# Altium project pca10095.PrjPCB (part 4 of 5)

## Sheet pca10095_sheet6_power_supply.SchDoc: PCA10095 - Power Supply
size A3; Organization: Nordic Semiconductor; DocumentNumber: 6; Revision: 2.0.0; SheetNumber: 6; SheetTotal: 6; Author: GETR; CompanyName: Nordic Semiconductor; ProjectName: nRF53 Development Kit
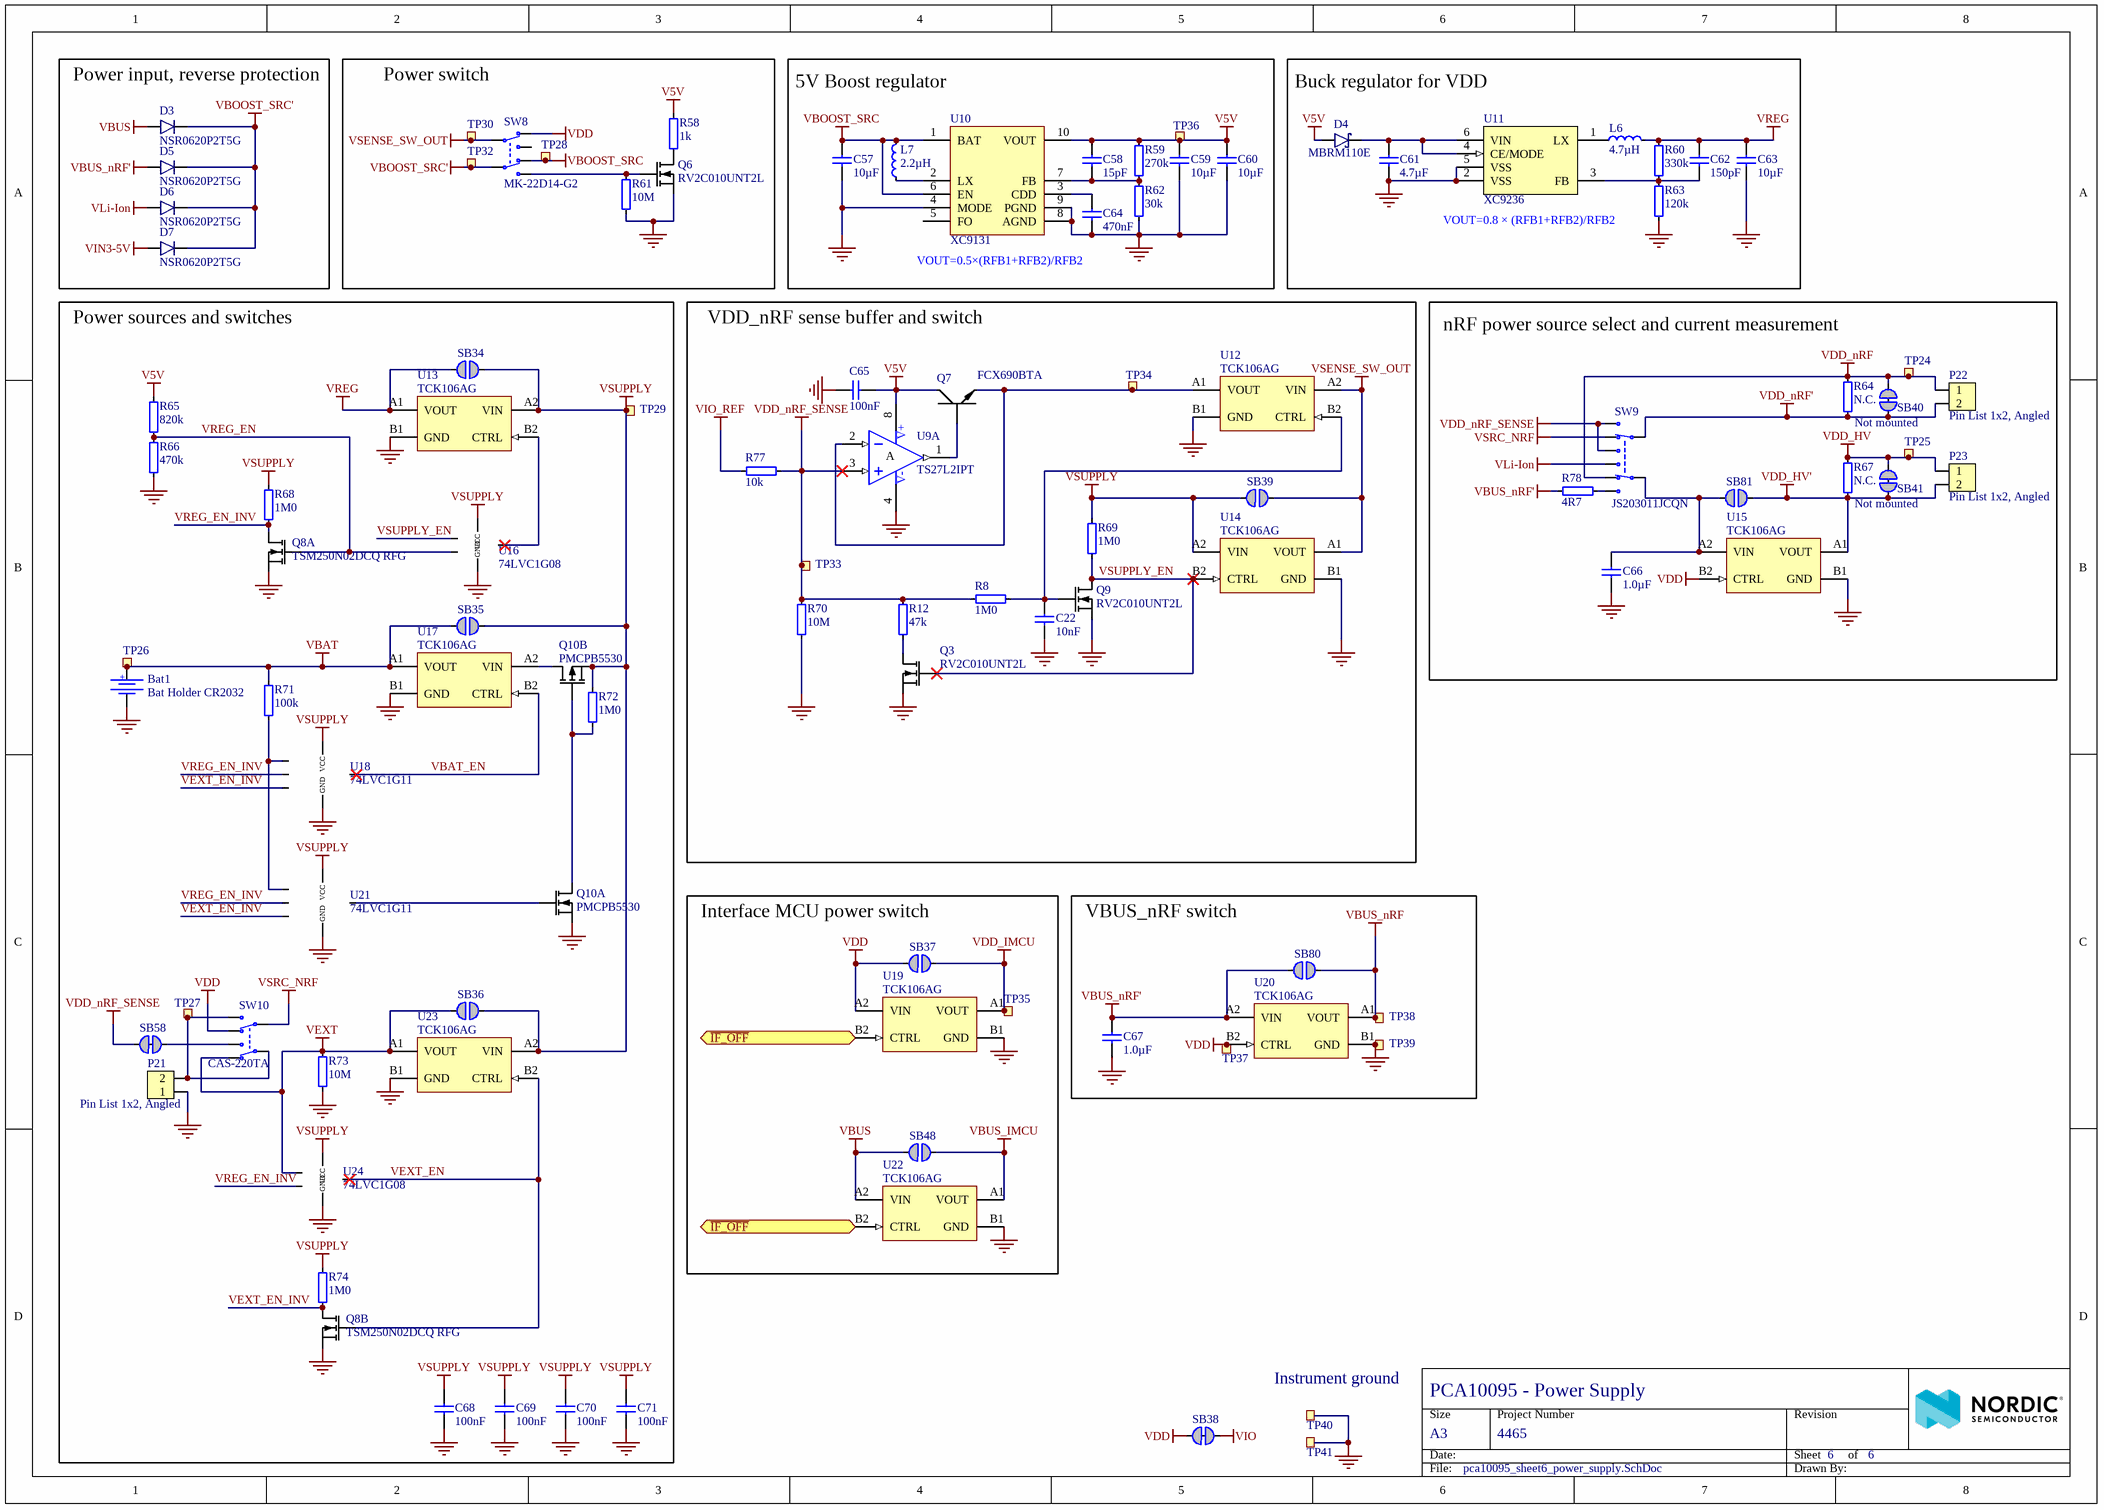
[diagram p5: pca10095_sheet6_power_supply.SchDoc]

### Parts
Bat1  Bat Holder CR2032  [L-KLS5-CR2032-23-B1]
C22  10nF  [CAPC0603X03L_C]
C57  10µF  [CAPC1608X06L]
C58  15pF  [CAPC0603X03L_C]
C59  10µF  [CAPC1608X06L]
C60  10µF  [CAPC1608X06L]
C61  4.7µF  [CAPC1005X04L]
C62  150pF  [CAPC0603X03L_C]
C63  10µF  [CAPC1608X06L]
C64  470nF  [CAPC0603X03L_C]
C65  100nF  [CAPC0603X03L_C]
C66  1.0µF  [CAPC1005X04L]
C67  1.0µF  [CAPC1608X06L]
C68  100nF  [CAPC0603X03L_C]
C69  100nF  [CAPC0603X03L_C]
C70  100nF  [CAPC0603X03L_C]
C71  100nF  [CAPC0603X03L_C]
D3  NSR0620P2T5G  [SODFL100X40-2N]
D4  MBRM110E  [DO-216AA]
D5  NSR0620P2T5G  [SODFL100X40-2N]
D6  NSR0620P2T5G  [SODFL100X40-2N]
D7  NSR0620P2T5G  [SODFL100X40-2N]
L6  4.7µH  [TY-NR3015]
L7  2.2µH  [TY-NR3015]
P21  Pin List 1x2, Angled  [LIST_ANG_1x2-SMD-2.54MM]
P22  Pin List 1x2, Angled  [LIST_ANG_1x2-SMD-2.54MM]
P23  Pin List 1x2, Angled  [LIST_ANG_1x2-SMD-2.54MM]
Q3  RV2C010UNT2L  [DFN65P100X40-3L]
Q6  RV2C010UNT2L  [DFN65P100X40-3L]
Q7  FCX690BTA  [SOT89-150P409X160-3N]
Q8  TSM250N02DCQ RFG  [DFN65P200X200X80_HS-6N]  (parts A,B of 2)
Q9  RV2C010UNT2L  [DFN65P100X40-3L]
Q10  PMCPB5530  [PMCPB5530X]  (parts A,B of 2)
R8  1M0  [RESC0603X03L_C]
R12  47k  [RESC0603X03L_C]
R58  1k  [RESC0603X03L_C]
R59  270k  [RESC0603X03L_C]
R60  330k  [RESC0603X03L_C]
R61  10M  [RESC0603X03L_C]
R62  30k  [RESC0603X03L_C]
R63  120k  [RESC0603X03L_C]
R64  N.C.  Assembly: Not mounted  [RESC1005X04L_NC]
R65  820k  [RESC0603X03L_C]
R66  470k  [RESC0603X03L_C]
R67  N.C.  Assembly: Not mounted  [RESC1005X04L_NC]
R68  1M0  [RESC0603X03L_C]
R69  1M0  [RESC0603X03L_C]
R70  10M  [RESC0603X03L_C]
R71  100k  [RESC0603X03L_C]
R72  1M0  [RESC0603X03L_C]
R73  10M  [RESC0603X03L_C]
R74  1M0  [RESC0603X03L_C]
R77  10k  [RESC0603X03L_C]
R78  4R7  [RESC0603X03L_C]
SB34  Solderbridge  [Solderbridge]  (value not drawn)  (no BOM)
SB35  Solderbridge  [Solderbridge]  (value not drawn)  (no BOM)
SB36  Solderbridge  [Solderbridge]  (value not drawn)  (no BOM)
SB37  Solderbridge  [Solderbridge]  (value not drawn)  (no BOM)
SB38  Solderbridge  [Solderbridge_Shorted]  (value not drawn)  (net tie, no BOM)
SB39  Solderbridge  [Solderbridge]  (value not drawn)  (no BOM)
SB40  Solderbridge  [Solderbridge_Shorted]  (value not drawn)  (net tie, no BOM)
SB41  Solderbridge  [Solderbridge_Shorted]  (value not drawn)  (net tie, no BOM)
SB48  Solderbridge  [Solderbridge]  (value not drawn)  (no BOM)
SB58  Solderbridge  [Solderbridge_Shorted]  (value not drawn)  (net tie, no BOM)
SB80  Solderbridge  [Solderbridge]  (value not drawn)  (no BOM)
SB81  Solderbridge  [Solderbridge]  (value not drawn)  (no BOM)
SW8  MK-22D14-G2  [MK-22D14-G2]
SW9  JS203011JCQN  [Switch-Slide-J-Lead-DP3T-13x3.5mm]
SW10  CAS-220TA  [CAS-220TA]
TP24  Ø1.5mm,SMD  [TP_SMD_Ø1.5mm]  (value not drawn)  (no BOM)
TP25  Ø1.5mm,SMD  [TP_SMD_Ø1.5mm]  (value not drawn)  (no BOM)
TP26  Ø1.5mm,SMD  [TP_SMD_Ø1.5mm]  (value not drawn)  (no BOM)
TP27  Ø1.5mm,SMD  [TP_SMD_Ø1.5mm]  (value not drawn)  (no BOM)
TP28  Ø1.5mm,SMD  [TP_SMD_Ø1.5mm]  (value not drawn)  (no BOM)
TP29  Ø1.0mm,SMD  [TP_SMD_Ø1.0mm]  (value not drawn)  (no BOM)
TP30  Ø1.5mm,SMD  [TP_SMD_Ø1.5mm]  (value not drawn)  (no BOM)
TP32  Ø1.5mm,SMD  [TP_SMD_Ø1.5mm]  (value not drawn)  (no BOM)
TP33  Ø1.0mm,SMD  [TP_SMD_Ø1.0mm]  (value not drawn)  (no BOM)
TP34  Ø1.0mm,SMD  [TP_SMD_Ø1.0mm]  (value not drawn)  (no BOM)
TP35  Ø1.5mm,SMD  [TP_SMD_Ø1.5mm]  (value not drawn)  (no BOM)
TP36  Ø1.0mm,SMD  [TP_SMD_Ø1.0mm]  (value not drawn)  (no BOM)
TP37  Ø1.5mm,SMD  [TP_SMD_Ø1.5mm]  (value not drawn)  (no BOM)
TP38  Ø1.5mm,SMD  [TP_SMD_Ø1.5mm]  (value not drawn)  (no BOM)
TP39  Ø1.5mm,SMD  [TP_SMD_Ø1.5mm]  (value not drawn)  (no BOM)
TP40  TP  [TESTPAD-TH]  (value not drawn)  (no BOM)
TP41  TP  [TESTPAD-TH]  (value not drawn)  (no BOM)
U9  TS27L2IPT  [TSOP65P640X120-8N]  (part A of 2)
U10  XC9131  [10-USPB (2.9x2.6)]
U11  XC9236  [USP-6C]
U12  TCK106AG  [BGA4C40P2X2_76X76X62]
U13  TCK106AG  [BGA4C40P2X2_76X76X62]
U14  TCK106AG  [BGA4C40P2X2_76X76X62]
U15  TCK106AG  [BGA4C40P2X2_76X76X62]
U16  74LVC1G08  [SOT65P210X100-5N]
U17  TCK106AG  [BGA4C40P2X2_76X76X62]
U18  74LVC1G11  [SOT65P210X100-6N]
U19  TCK106AG  [BGA4C40P2X2_76X76X62]
U20  TCK106AG  [BGA4C40P2X2_76X76X62]
U21  74LVC1G11  [SOT65P210X100-6N]
U22  TCK106AG  [BGA4C40P2X2_76X76X62]
U23  TCK106AG  [BGA4C40P2X2_76X76X62]
U24  74LVC1G08  [SOT65P210X100-5N]

### Blocks framed on the sheet
Power input, reverse protection: D3 D5-D7
Power switch: Q6 R58 R61 SW8 TP28 TP30 TP32
5V Boost regulator: C57-C60 C64 L7 R59 R62 TP36 U10
Buck regulator for VDD: C61-C63 D4 L6 R60 R63 U11
Power sources and switches: Bat1 C68-C71 P21 Q8 Q10 R65 R66 R68 R71-R74 SB34-SB36 SB58 SW10 TP26 TP27 TP29 U13 U16-U18 U21 U23 U24
VDD_nRF sense buffer and switch: C22 C65 Q3 Q7 Q9 R8 R12 R69 R70 R77 SB39 TP33 TP34 U9 U12 U14
nRF power source select and current measurement: C66 P22 P23 R64 R67 R78 SB40 SB41 SB81 SW9 TP24 TP25 U15
Interface MCU power switch: SB37 SB48 TP35 U19 U22
VBUS_nRF switch: C67 SB80 TP37-TP39 U20

### Ports
~{IF_OFF} (bidir)

### Nets
GND: Bat1.2 C22.2 C57.1 C59.1 C60.1 C61.1 C63.1 C64.1 C65.1 C66.1 C67.1 C68.1 C69.1 C70.1 C71.1 P21.1 Q3.2(S) Q6.2(S) Q8.1(S1) Q8.4(S2) Q9.2(S) Q10.1(S1) R61.2 R62.1 R63.1 R66.2 R70.2 R73.2 TP39.1 TP40.1 TP41.1 U9.4(V-) U10.4(MODE) U10.8(AGND) U10.9(PGND) U10.11(GND) U11.2(VSS) U11.5(VSS) U11.7(VSS) U12.B1(GND) U13.B1(GND) U14.B1(GND) U15.B1(GND) U16.3(GND) U17.B1(GND) U18.2(GND) U19.B1(GND) U20.B1(GND) U21.2(GND) U22.B1(GND) U23.B1(GND) U24.3(GND)
V5V: C58.2 C59.2 C60.2 C65.2 D4.1(A) Q7.2(C) R58.1 R59.2 R65.1 TP36.1 U9.8(V+) U10.10(VOUT)
VBAT: Bat1.1 R71.1 SB35.2 TP26.1 U17.A1(VOUT)
VBOOST_SRC: C57.2 L7.2 SW8.6(N.C-2) TP28.1 U10.1(BAT) U10.6(EN)
VBOOST_SRC': D3.1(C) D5.1(C) D6.1(C) D7.1(C) SW8.5(COM-2) TP32.1
VBUS: D3.2(A) SB48.2 U22.A2(VIN)
VBUS_IMCU: SB48.1 U22.A1(VOUT)
VBUS_nRF: SB80.1 TP38.1 U20.A1(VOUT)
VBUS_nRF': C67.2 D5.2(A) R78.1 SB80.2 U20.A2(VIN)
VDD: SB37.2 SB38.2 SW8.3(N.C-1) SW10.6(N.C-2) TP37.1 U15.B2(CTRL) U19.A2(VIN) U20.B2(CTRL)
VDD_HV: P23.1 R67.2 SB41.1 TP25.1
VDD_HV': P23.2 R67.1 SB41.2 SB81.1 U15.A1(VOUT)
VDD_IMCU: SB37.1 TP35.1 U19.A1(VOUT)
VDD_nRF: P22.1 R64.2 SB40.1 SW9.6(N.C) TP24.1
VDD_nRF': P22.2 R64.1 SB40.2 SW9.3(COM)
VDD_nRF_SENSE: R8.1 R12.1 R70.1 R77.1 SB58.1 SW9.1(N.O) SW9.4(N.O) TP33.1 U9.3(IN1+)
VEXT: R73.1 SB36.2 SW10.3(N.C-1) U23.A1(VOUT) U24.1(A)
VIN3-5V: D7.2(A)
VIO: SB38.1
VIO_REF: R77.2
VLi-Ion: D6.2(A) SW9.5(N.O)
VREG: C62.2 C63.2 L6.2 R60.2 SB34.2 U13.A1(VOUT)
VSENSE_SW_OUT: SB39.1 SW8.2(COM-1) TP30.1 U12.A2(VIN) U14.A1(VOUT)
VSRC_NRF: SW9.2(N.C) SW10.5(COM-2)
VSUPPLY: C68.2 C69.2 C70.2 C71.2 Q10.4(S2) R68.1 R69.1 R72.1 R74.1 SB34.1 SB35.1 SB36.1 SB39.2 TP29.1 U13.A2(VIN) U14.A2(VIN) U16.5(VCC) U18.5(VCC) U21.5(VCC) U23.A2(VIN) U24.5(VCC)
~{IF_OFF}: U19.B2(CTRL) U22.B2(CTRL) ; port ~{IF_OFF}
VBAT_EN: U17.B2(CTRL) U18.4(Y)
VEXT_EN: Q8.5(G2) U23.B2(CTRL) U24.4(Y)
VEXT_EN_INV: Q8.3(D2) R74.2 U18.6(C) U21.6(C)
VREG_EN: Q8.2(G1) R65.2 R66.1 U16.2(B)
VREG_EN_INV: Q8.6(D1) R68.2 U18.3(B) U21.3(B) U24.2(B)
VSUPPLY_EN: Q3.1(G) Q9.3(D) R69.2 U14.B2(CTRL) U16.1(A)
NetC22_1: C22.1 Q9.1(G) R8.2 U12.B2(CTRL)
NetC58_1: C58.1 R59.1 R62.2 U10.7(FB)
NetC61_2: C61.2 D4.3(C) U11.4(CE/MODE) U11.6(VIN)
NetC62_1: C62.1 R60.1 R63.2 U11.3(FB)
NetC64_2: C64.2 U10.3(CDD)
NetC66_2: C66.2 SB81.2 SW9.7(COM) U15.A2(VIN)
NetL6_1: L6.1 U11.1(LX)
NetL7_1: L7.1 U10.2(LX)
NetP21_2: P21.2 SW10.2(COM-1) SW10.4(N.O-2) TP27.1
NetQ3_3: Q3.3(D) R12.2
NetQ6_1: Q6.1(G) R61.1 SW8.4(N.O-2)
NetQ6_3: Q6.3(D) R58.2
NetQ7_1: Q7.1(B) U9.1(OUT1)
NetQ7_3: Q7.3(E) TP34.1 U9.2(IN1-) U12.A1(VOUT)
NetQ10_2: Q10.2(G1) U21.4(Y)
NetQ10_3: Q10.3(D2) U17.A2(VIN)
NetQ10_5: Q10.5(G2) Q10.6(D1) R72.2
NetR71_2: R71.2 U18.1(A) U21.1(A)
NetR78_2: R78.2 SW9.8(N.O)
NetSB58_2: SB58.2 SW10.1(N.O-1)
NetU13_B2: U13.B2(CTRL) U16.4(Y)

Not connected (* = marked no-connect by the designer): SW8 1(N.O-1); U10 5(FO)

### Notes on the sheet
- VOUT=0.8 × (RFB1+RFB2)/RFB2
- VOUT=0.5×(RFB1+RFB2)/RFB2
- (near TP40) Instrument ground
- Size
- Date:
- A3
- Project Number
- Sheet         of
- Revision
- File:
- Drawn By:
- (in symbol Bat Holder L-KLS5-CR2032-23-B1) +
- (in symbol TS27L2IPT, part A) A

### Library data of the parts
Bat1 = Bat Holder L-KLS5-CR2032-23-B1: Bat Holder CR2032 SMD; Manufacturer: KLS Electronic; Artikkelnr Noca: N.A.; Pad Count: 2; Part Number: Bat Holder L-KLS5-CR2032-23-B1; Manufacturer Part Number: L-KLS5-CR2032-23-B1; ComponentLink1URL: http://www.klsele.com/admin/product_upload/20151124103736KLS5-CR2032-23-B.pdf; ComponentLink1Description: Datasheet; ComponentLink2URL: N.A.; ComponentLink2Description: Supplier link; HelpURL: http://www.klsele.com/products/connectors/Coin-Cell-Holders-Series/4685.html; Footprint Doc: CR2032_HOLDER; LatestRevisionDate: 2019-08-29; Published: 2019-08-28; Value: Bat Holder CR2032; Note: Bat Holder CR2032; Supplier 1: Cabcon; Supplier Part Number 1: L-KLS5-CR2032-23-B1; Supplier 2: Mouser; Supplier Part Number 2: 614-SMTU2032-LF; Part number IPS: N.A.; PartId: 100500651; Component Class: Connectors; Author: rsk; Part number Norautron: N.A.
C22 = C0201-10n: Capacitor, X7R, ±10%; Manufacturer: N.A.; Part number IPS: 00000003480; Note: 10V; Pad Count: 2; Part Number: C0201-10n; LatestRevisionDate: 2017-11-09; Published: 2014-11-13; Value: 10nF; Footprint Doc: 0201; Manufacturer Part Number: N.A.; Artikkelnr Noca: N.A.; ComponentLink1URL: N.A.; ComponentLink1Description: Datasheet; ComponentLink2URL: N.A.; ComponentLink2Description: Supplier link; HelpURL: N.A.; Supplier 1: N.A.; Supplier Part Number 1: N.A.; Supplier 2: N.A.; Supplier Part Number 2: N.A.; Component Class: Capacitors; PartId: 100200067
C57 C59 C60 C63 = C0603-10µ-25V: Capacitor, X5R, ±20%, 25V; Manufacturer: Samsung Electro-Mechanics America; Manufacturer Part Number: CL10A106MA8NRNC; Part number IPS: 00000009948; Part number Norautron: N.A.; Artikkelnr Noca: 20039436; Pad Count: 2; Part Number: C0603-10µ-25V; Footprint Doc: 0603; LatestRevisionDate: 2015-04-10; Published: 2015-04-10; Value: 10µF; Note: 25V; ComponentLink1URL: N.A.; ComponentLink1Description: Datasheet; ComponentLink2URL: N.A.; ComponentLink2Description: Supplier link; HelpURL: http://www.samsungsem.com/kr/front/downloadcms.do?path=/kr/support/product-search/mlcc/__icsFiles/afieldfile/2014/11/05&fileName=S_CL10A106MA8NRNC.pdf; Supplier 1: Digi-Key; Supplier Part Number 1: 1276-1869-1-ND; Supplier 2: N.A.; Supplier Part Number 2: N.A.; PartId: 100200354; Component Class: Capacitors; Author: rsk
C58 = C0201-15p-25V-COG: Ceramic Capacitor C0G, NP0 0201, ±5% 25V; Manufacturer: Walsin Technology Corporation; Manufacturer Part Number: 0201N150J250CT; Note: Chip Cap 5%; Artikkelnr Noca: N.A.; Pad Count: 2; Part Number: C0201-15p-25V-COG; Footprint Doc: 0201; LatestRevisionDate: 2020-10-13; Pin Count: 2; Publisher: Nordic Semiconductor; Published: 2020-03-17; Value: 15pF; Part number IPS: N.A.; ComponentLink1URL: http://www.passivecomponent.com/wp-content/uploads/ecd/0201N150J250CT-IL.pdf; ComponentLink1Description: Datasheet; ComponentLink2URL: https://www.digikey.no/product-detail/en/walsin-technology-corporation/0201N150J250CT/1292-1138-1-ND/9355142; ComponentLink2Description: Supplier link; HelpURL: N.A.; Supplier 1: Digi-Key; Supplier Part Number 1: 1292-1138-1-ND; Supplier 2: N.A.; Supplier Part Number 2: N.A.; Component Class: Capacitors; PartId: 100200443
C61 = C0402-4µ7-10V-X5R: CAP CER 4.7UF 10V X5R 0402; Manufacturer: Murata; Manufacturer Part Number: GRM155R61A475MEAAD; Artikkelnr Noca: N.A.; Pad Count: 2; Part Number: C0402-4µ7-10V-X5R; ComponentLink1URL: http://search.murata.co.jp/Ceramy/image/img/A01X/G101/ENG/GRM155R61A475MEAA-01.pdf; ComponentLink1Description: Datasheet; ComponentLink2URL: https://www.digikey.com/product-detail/en/murata-electronics-north-america/GRM155R61A475MEAAD/490-14306-1-ND/6234742; ComponentLink2Description: Supplier link; HelpURL: https://psearch.en.murata.com/capacitor/product/GRM155R61A475MEAA%23.html; Footprint Doc: 0402; LatestRevisionDate: 2020-10-13; Pin Count: 2; Publisher: Nordic Semiconductor; Published: 2018-10-04; Value: 4.7µF; Note: 10V; Supplier 1: Digi-Key; Supplier Part Number 1: 490-14306-1-ND; Supplier 2: N.A.; Supplier Part Number 2: N.A.; Part number IPS: N.A.; Component Class: Capacitors; PartId: 100200415
C62 = C0201-150p-25V-COG: Ceramic Capacitor C0G, NP0 0201, ±5% 25V; Manufacturer: Murata; Manufacturer Part Number: GRM0335C1E151JA01D; Note: Chip Cap 5%; Artikkelnr Noca: N.A.; Pad Count: 2; Part Number: C0201-150p-25V-COG; Footprint Doc: 0201; LatestRevisionDate: 2020-10-13; Pin Count: 2; Publisher: Nordic Semiconductor; Published: 2020-03-17; Value: 150pF; Part number IPS: N.A.; ComponentLink1URL: https://www.mouser.com/datasheet/2/281/murata_03052018_GRM_Series_1-1310166.pdf; ComponentLink1Description: Datasheet; ComponentLink2URL: https://www.mouser.com/ProductDetail/Murata-Electronics/GRM0335C1E151JA01D?qs=%2Fha2pyFaduiNjPL6xbzKSo%252BchgTMqklsGrBRdYVX326W%252BRpjq1WqAQZ5mC%252Bu6szW; ComponentLink2Description: Supplier link; HelpURL: N.A.; Supplier 1: Digi-Key; Supplier Part Number 1: 1292-1138-1-ND; Supplier 2: N.A.; Supplier Part Number 2: N.A.; Component Class: Capacitors; PartId: 100200444
C64 = C0201-470n-16V-X5R: Ceramic Capacitor X5R 0201, ±10% 16V; Manufacturer: Taiyo Yuden; Manufacturer Part Number: EMK063BBJ474KPLF; Artikkelnr Noca: N.A.; Pad Count: 2; Part Number: C0201-470n-16V-X5R; Footprint Doc: 0201; LatestRevisionDate: 2020-10-13; Pin Count: 2; Publisher: Nordic Semiconductor; Published: 2020-03-05; Value: 470nF; Note: 16V; Part number IPS: N.A.; ComponentLink1URL: https://ds.yuden.co.jp/TYCOMPAS/ut/specSheet?pn=EMK063BBJ474KPLF; ComponentLink1Description: Datasheet; ComponentLink2URL: https://ds.yuden.co.jp/TYCOMPAS/ut/sm/detail?pn=EMK063BBJ474KPLF&u=M; ComponentLink2Description: Supplier link; HelpURL: https://www.digikey.no/products/en?keywords=587-6264-1-ND; Supplier 1: Digi-Key; Supplier Part Number 1: 587-6264-1-ND; Supplier 2: N.A.; Supplier Part Number 2: N.A.; Component Class: Capacitors; PartId: 100200442
C65 C68-C71 = C0201-100n: Capacitor, X5R, ±10%; Manufacturer: N.A.; Part number IPS: 00000001248, 00000002505; Note: 16V; Pad Count: 2; Part Number: C0201-100n; Manufacturer Part Number: N.A.; Footprint Doc: 0201; LatestRevisionDate: 2017-11-09; Pin Count: 2; Publisher: Nordic Semiconductor; Published: 2014-11-13; Value: 100nF; Artikkelnr Noca: N.A.; ComponentLink1URL: N.A.; ComponentLink1Description: Datasheet; ComponentLink2URL: N.A.; ComponentLink2Description: Supplier link; HelpURL: N.A.; Supplier 1: N.A.; Supplier Part Number 1: N.A.; Supplier 2: N.A.; Supplier Part Number 2: N.A.; Component Class: Capacitors; PartId: 100200078
C66 = C0402-1µ0: Capacitor, X5R, ±5%, 6.3V; Manufacturer: N.A.; Part number IPS: 00000007786, 00000003457; Artikkelnr Noca: 20039235; Pad Count: 2; Part Number: C0402-1µ0; Manufacturer Part Number: N.A.; LatestRevisionDate: 2016-08-22; Pin Count: 2; Publisher: Nordic Semiconductor; Published: 2009-05-08; Value: 1.0µF; Note: 6.3V; Footprint Doc: 0402; ComponentLink1URL: N.A.; ComponentLink1Description: Datasheet; ComponentLink2URL: N.A.; ComponentLink2Description: Supplier link; HelpURL: N.A.; Supplier 1: Digi-Key; Supplier Part Number 1: 1276-1444-1-ND; Supplier 2: N.A.; Supplier Part Number 2: N.A.; Component Class: Capacitors; PartId: 100200190
C67 = C0603-1µ0: Capacitor, X7R, ±10%; Manufacturer: N.A.; Part number IPS: 00000000616; Note: 16V; Artikkelnr Noca: 20039282; Pad Count: 2; Part Number: C0603-1µ0; Manufacturer Part Number: N.A.; Footprint Doc: 0603; LatestRevisionDate: 2013-06-05; Pin Count: 2; Publisher: Nordic Semiconductor; Published: 2009-05-08; Value: 1.0µF; ComponentLink1URL: N.A.; ComponentLink1Description: Datasheet; ComponentLink2URL: N.A.; ComponentLink2Description: Supplier link; HelpURL: N.A.; Supplier 1: N.A.; Supplier Part Number 1: N.A.; Supplier 2: N.A.; Supplier Part Number 2: N.A.; Component Class: Capacitors; PartId: 100200271
D3 D5-D7 = NSR0620P2T5G: 20V schottky barrier diode, Vf 350 mV @ 100 mA, Ir 2.0 µA @ 10 V, If 500 mA; Manufacturer: ON Semiconductor; Part number IPS: 00000009952; Note: N.A.; Artikkelnr Noca: 10029169; Pad Count: 2; Part Number: NSR0620P2T5G; Manufacturer Part Number: NSR0620P2T5G; LatestRevisionDate: 2016-07-07; Publisher: Nordic Semiconductor; Published: 2016-07-07; Value: NSR0620P2T5G; Footprint Doc: SOD-923; ComponentLink1URL: N.A.; ComponentLink1Description: Datasheet; ComponentLink2URL: N.A.; ComponentLink2Description: Supplier link; HelpURL: http://www.onsemi.com/pub_link/Collateral/NSR0620P2-D.PDF; Pin Count: 2; Supplier 1: Digi-Key; Supplier Part Number 1: NSR0620P2T5GOSCT-ND; Supplier 2: N.A.; Supplier Part Number 2: N.A.; Component Class: Semiconductors; PartId: 101300131
D4 = MBRM110E: Diode Schottky Vf=0.455V @ 100mA, Vr=10V, If=1000mA, Ir=1µA @ 10V; Manufacturer: ON Semiconductor; Manufacturer Part Number: MBRM110ET1G; Part number IPS: 00000009953; Note: N.A.; Artikkelnr Noca: 10029172; Pad Count: 2; Part Number: MBRM110E; Footprint Doc: DO-216AA; LatestRevisionDate: 2016-10-24; Publisher: Nordic Semiconductor; Published: 2016-10-24; Value: MBRM110E; ComponentLink1URL: N.A.; ComponentLink1Description: Datasheet; ComponentLink2URL: N.A.; ComponentLink2Description: Supplier link; HelpURL: http://media.digikey.com/pdf/Data%20Sheets/ON%20Semiconductor%20PDFs/MBRM110E-D.pdf; Pin Count: 2; Supplier 1: Digi-Key; Supplier Part Number 1: MBRM110ET1GOSTR-ND; Supplier 2: Farnell; Supplier Part Number 2: 236-9429; Component Class: Semiconductors; PartId: 101300099
L6 = NR3015-4µ7-1.04A-144mOhm: Ferrite Inductor, Shielded, 1,04A, 144mOhm; Manufacturer: Taiyo Yuden; Manufacturer Part Number: NR3015T4R7M; Part number IPS: 00000009960; Note: N.A.; Artikkelnr Noca: 33029551; Pad Count: 2; Part Number: NR3015-4µ7-1.04A-144mOhm; Footprint Doc: 1212; LatestRevisionDate: 2014-01-22; Pin Count: 2; Publisher: Nordic Semiconductor; Published: 2014-01-22; Value: 4.7µH; ComponentLink1Description: Datasheet; ComponentLink2Description: Supplier link; ComponentLink1URL: N.A.; ComponentLink2URL: N.A.; HelpURL: http://www.yuden.co.jp/ut/product/category/inductor/NR3015T4R7M.pdf; Supplier 1: Digi-Key; Supplier Part Number 1: 587-1649-1-ND; Supplier 2: Mouser; Supplier Part Number 2: 963-NR3015T4R7M; Component Class: Inductors; PartId: 100300145
L7 = NR3015-2µ2-1.5A-72mOhm: Ferrite Inductor, Shielded, 1,5A, 72mOhm; Manufacturer: Taiyo Yuden; Manufacturer Part Number: NR3015T2R2M; Part number IPS: 00000009959; Note: N.A.; Artikkelnr Noca: 33029487; Pad Count: 2; Part Number: NR3015-2µ2-1.5A-72mOhm; Footprint Doc: 1212; LatestRevisionDate: 2014-01-22; Pin Count: 2; Publisher: Nordic Semiconductor; Published: 2014-01-22; Value: 2.2µH; ComponentLink1Description: Datasheet; ComponentLink2Description: Supplier link; ComponentLink1URL: N.A.; ComponentLink2URL: N.A.; HelpURL: http://www.yuden.co.jp/ut/product/category/inductor/NR3015T2R2M.pdf; Supplier 1: Digi-Key; Supplier Part Number 1: 587-1648-1-ND; Supplier 2: Farnell; Supplier Part Number 2: 188-5853; Component Class: Inductors; PartId: 100300143
P21-P23 = Pin List Ang 1x2 SMD, 2.54mm: Pin List 1x2, 2.54mm (100mil), Right Angled, SMD; Manufacturer: W-CON; Manufacturer Part Number: 1125B-1102S0Z135R2; Part number IPS: 00000009972; Note: N.A.; Artikkelnr Noca: 55010023; Pad Count: 2; Part Number: Pin List Ang 1x2 SMD, 2.54mm; Footprint Doc: LIST_ANG_1x2-SMD-2.54MM; LatestRevisionDate: 2016-05-26; Pin Count: 2; Publisher: Nordic Semiconductor; Published: 2016-01-22; Value: Pin List 1x2, Angled; ComponentLink1URL: N.A.; ComponentLink1Description: Datasheet; ComponentLink2URL: N.A.; ComponentLink2Description: Supplier link; HelpURL: \\hizz\pro\app9717\Datasheet\connectors\W-CON\1125B-11XXXXZXXXXX.pdf; Supplier 1: Cabcon; Supplier Part Number 1: 1125B-1102S0Z135R2; Supplier 2: Samtec; Supplier Part Number 2: TSM-102-01-L-SH-A; Component Class: Connectors; PartId: 100500354
Q3 Q6 Q9 = RV2C010UNT2L: N-Channel MOSFET, 20V, 1A, 470mOhm, 400mW; Manufacturer: Rohm Semiconductor; Part number IPS: 00000009976; Note: N.A.; Artikkelnr Noca: 35010020; Pad Count: 3; Part Number: RV2C010UNT2L; Manufacturer Part Number: RV2C010UNT2L; LatestRevisionDate: 2016-08-09; Publisher: Nordic Semiconductor; Published: 2016-08-09; Value: RV2C010UNT2L; Footprint Doc: DFN-3; ComponentLink1URL: N.A.; ComponentLink1Description: Datasheet; ComponentLink2URL: N.A.; ComponentLink2Description: Supplier link; HelpURL: http://rohmfs.rohm.com/en/products/databook/datasheet/discrete/transistor/mosfet/rv2c010unt2l-e.pdf; Pin Count: 3; Supplier 1: Digi-Key; Supplier Part Number 1: RV2C010UNT2LCT-ND; Supplier 2: Mouser; Supplier Part Number 2: 755-RV2C010UNT2L; Component Class: Semiconductors; PartId: 101300132
Q7 = FCX690BTA: 45V NPN high gain power transistor; Manufacturer: Diodes Incorporated; Part number IPS: 00000009974; Note: N.A.; Artikkelnr Noca: 35010019; Pad Count: 3; Part Number: FCX690BTA; Manufacturer Part Number: FCX690BTA; Footprint Doc: SOT-89; LatestRevisionDate: 2016-07-07; Publisher: Nordic Semiconductor; Published: 2016-07-07; Value: FCX690BTA; ComponentLink1URL: N.A.; ComponentLink1Description: Datasheet; ComponentLink2URL: N.A.; ComponentLink2Description: Supplier link; HelpURL: http://www.diodes.com/_files/datasheets/FCX690B.pdf; Pin Count: 3; Supplier 1: Digi-Key; Supplier Part Number 1: FCX690BCT-ND; Supplier 2: N.A.; Supplier Part Number 2: N.A.; Component Class: Semiconductors; PartId: 101300130
Q8 = TSM250N02DCQ RFG: Dual N Ch MOFET, 5.8A, 55mOhm max, 620mW; Manufacturer: Taiwan Semiconductor; Part number IPS: 00000001703; Note: N.A.; Pad Count: 6; Part Number: TSM250N02DCQ RFG; Manufacturer Part Number: TSM250N02DCQ RFG; LatestRevisionDate: 2018-10-31; Pin Count: 6; Publisher: Nordic Semiconductor; Published: 2018-10-31; Value: TSM250N02DCQ RFG; Artikkelnr Noca: N.A.; Footprint Doc: VDFN-6; ComponentLink1URL: https://www.taiwansemi.com/products/datasheet/TSM250N02D_B15.pdf; ComponentLink1Description: Datasheet; ComponentLink2URL: N.A.; ComponentLink2Description: Supplier link; HelpURL: https://www.taiwansemi.com/products/datasheet/TSM250N02D_B15.pdf; Supplier 1: Digi-Key; Supplier Part Number 1: TSM250N02DCQRFGCT-ND; Supplier 2: N.A.; Supplier Part Number 2: N.A.; Component Class: Semiconductors; PartId: 101300161
Q10 = PMCPB5530X,115: Mosfet Array N and P-Channel 20V 4A (Ta), 3.4A (Ta) 490mW Surface Mount 6-HUSON-EP (2x2); Manufacturer: Nexperia; Part number IPS: 00000001918; Note: N.A.; Pad Count: 8; Part Number: PMCPB5530X,115; Manufacturer Part Number: PMCPB5530X,115; ComponentLink1URL: https://assets.nexperia.com/documents/data-sheet/PMCPB5530X.pdf; ComponentLink1Description: Datasheet; ComponentLink2URL: https://www.digikey.com/product-detail/en/nexperia-usa-inc/PMCPB5530X115/1727-1327-1-ND/4386339; ComponentLink2Description: Supplier link; HelpURL: https://www.nexperia.com/products/mosfets/small-signal-mosfets/PMCPB5530X.html; Footprint Doc: 6-UDFN; LatestRevisionDate: 2018-04-30; Pin Count: 8; Publisher: Nordic Semiconductor; Published: 2018-04-30; Value: PMCPB5530; Supplier 1: Digi-Key; Supplier Part Number 1: 1727-1327-1-ND; Supplier 2: Mouser; Supplier Part Number 2: 771-PMCPB5530X115; Artikkelnr Noca: N.A.; Component Class: Semiconductors; PartId: 101300165
R8 R68 R69 R72 R74 = R0201-1M0: Resistor, ±1%, 0.05W; Manufacturer: N.A.; Part number IPS: 00000001418; Note: Chip Res 1%; Pad Count: 2; Part Number: R0201-1M0; Manufacturer Part Number: N.A.; LatestRevisionDate: 2014-11-13; Pin Count: 2; Publisher: Nordic Semiconductor; Published: 2014-11-13; Value: 1M0; Artikkelnr Noca: N.A.; Footprint Doc: 0201; ComponentLink1URL: N.A.; ComponentLink1Description: Datasheet; ComponentLink2URL: N.A.; ComponentLink2Description: Supplier link; HelpURL: N.A.; Supplier 1: N.A.; Supplier Part Number 1: N.A.; Supplier 2: N.A.; Supplier Part Number 2: N.A.; Component Class: Resistors; PartId: 100100093
R12 = R0201-47k: Resistor, ±1%, 0.05W; Manufacturer: N.A.; Part number IPS: 00000001423; Note: Chip Res 1%; Pad Count: 2; Part Number: R0201-47k; Manufacturer Part Number: N.A.; LatestRevisionDate: 2014-11-13; Published: 2014-11-13; Value: 47k; Artikkelnr Noca: N.A.; Footprint Doc: 0201; ComponentLink1URL: N.A.; ComponentLink1Description: Datasheet; ComponentLink2URL: N.A.; ComponentLink2Description: Supplier link; HelpURL: N.A.; Supplier 1: N.A.; Supplier Part Number 1: N.A.; Supplier 2: N.A.; Supplier Part Number 2: N.A.; Component Class: Resistors; PartId: 100100076
R58 = R0201-1k0: Resistor, ±1%, 0.05W; Manufacturer: N.A.; Part number IPS: 00000005786; Note: Chip Res 1%; Pad Count: 2; Part Number: R0201-1k0; Manufacturer Part Number: N.A.; LatestRevisionDate: 2014-11-13; Pin Count: 2; Publisher: Nordic Semiconductor; Published: 2014-11-13; Value: 1k; Artikkelnr Noca: N.A.; Footprint Doc: 0201; ComponentLink1URL: N.A.; ComponentLink1Description: Datasheet; ComponentLink2URL: N.A.; ComponentLink2Description: Supplier link; HelpURL: N.A.; Supplier 1: N.A.; Supplier Part Number 1: N.A.; Supplier 2: N.A.; Supplier Part Number 2: N.A.; Component Class: Resistors; PartId: 100100043
R59 = R0201-270k: Resistor, ±1%, 0.05W; Manufacturer: N.A.; Part number IPS: 00000004317; Note: Chip Res 1%; Pad Count: 2; Part Number: R0201-270k; Manufacturer Part Number: N.A.; Footprint Doc: 0201; LatestRevisionDate: 2014-11-13; Pin Count: 2; Publisher: Nordic Semiconductor; Published: 2014-11-13; Value: 270k; Artikkelnr Noca: N.A.; ComponentLink1URL: N.A.; ComponentLink1Description: Datasheet; ComponentLink2URL: N.A.; ComponentLink2Description: Supplier link; HelpURL: N.A.; Supplier 1: N.A.; Supplier Part Number 1: N.A.; Supplier 2: N.A.; Supplier Part Number 2: N.A.; Component Class: Resistors; PartId: 100100086
R60 = R0201-330k: Resistor, ±1%, 0.05W; Manufacturer: N.A.; Part number IPS: 00000001424; Note: Chip Res 1%; Pad Count: 2; Part Number: R0201-330k; Manufacturer Part Number: N.A.; Footprint Doc: 0201; LatestRevisionDate: 2014-11-13; Pin Count: 2; Publisher: Nordic Semiconductor; Published: 2014-11-13; Value: 330k; Artikkelnr Noca: N.A.; ComponentLink1URL: N.A.; ComponentLink1Description: Datasheet; ComponentLink2URL: N.A.; ComponentLink2Description: Supplier link; HelpURL: N.A.; Supplier 1: N.A.; Supplier Part Number 1: N.A.; Supplier 2: N.A.; Supplier Part Number 2: N.A.; Component Class: Resistors; PartId: 100100087
R61 R70 R73 = R0201-10M: Resistor, ±1%, 0.05W; Manufacturer: N.A.; Part number IPS: 00000001426; Note: Chip Res 1%; Pad Count: 2; Part Number: R0201-10M; Manufacturer Part Number: N.A.; LatestRevisionDate: 2014-11-13; Pin Count: 2; Publisher: Nordic Semiconductor; Published: 2014-11-13; Value: 10M; Artikkelnr Noca: N.A.; Footprint Doc: 0201; ComponentLink1URL: N.A.; ComponentLink1Description: Datasheet; ComponentLink2URL: N.A.; ComponentLink2Description: Supplier link; HelpURL: N.A.; Supplier 1: N.A.; Supplier Part Number 1: N.A.; Supplier 2: N.A.; Supplier Part Number 2: N.A.; Component Class: Resistors; PartId: 100100105
R62 = R0201-30k: Resistor, ±1%, 0.05W; Manufacturer: N.A.; Part number IPS: 00000004318; Note: Chip Res 1%; Pad Count: 2; Part Number: R0201-30k; Manufacturer Part Number: N.A.; Footprint Doc: 0201; LatestRevisionDate: 2016-04-20; Pin Count: 2; Publisher: Nordic Semiconductor; Published: 2016-04-20; Value: 30k; Artikkelnr Noca: N.A.; ComponentLink1URL: N.A.; ComponentLink1Description: Datasheet; ComponentLink2URL: N.A.; ComponentLink2Description: Supplier link; HelpURL: N.A.; Supplier 1: N.A.; Supplier Part Number 1: N.A.; Supplier 2: N.A.; Supplier Part Number 2: N.A.; Component Class: Resistors; PartId: 100100564
R63 = R0201-120k: Resistor, ±1%, 0.05W; Manufacturer: N.A.; Part number IPS: 00000001425; Note: Chip Res 1%; Pad Count: 2; Part Number: R0201-120k; Manufacturer Part Number: N.A.; Footprint Doc: 0201; LatestRevisionDate: 2014-11-13; Pin Count: 2; Publisher: Nordic Semiconductor; Published: 2014-11-13; Value: 120k; Artikkelnr Noca: N.A.; ComponentLink1URL: N.A.; ComponentLink1Description: Datasheet; ComponentLink2URL: N.A.; ComponentLink2Description: Supplier link; HelpURL: N.A.; Supplier 1: N.A.; Supplier Part Number 1: N.A.; Supplier 2: N.A.; Supplier Part Number 2: N.A.; Component Class: Resistors; PartId: 100100081
R64 R67 = R0402-N.C.: Not mounted; Manufacturer: N.A.; Note: Chip Res; Pad Count: 2; Part Number: R0402-N.C.; Manufacturer Part Number: N.A.; LatestRevisionDate: 2009-05-08; Pin Count: 2; Publisher: Nordic Semiconductor; Published: 2009-05-08; Value: N.C.; Artikkelnr Noca: N.A.; Footprint Doc: 0402; Part number IPS: N.A.; ComponentLink1URL: N.A.; ComponentLink1Description: Datasheet; ComponentLink2URL: N.A.; ComponentLink2Description: Supplier link; HelpURL: N.A.; Supplier 1: N.A.; Supplier Part Number 1: N.A.; Supplier 2: N.A.; Supplier Part Number 2: N.A.; Component Class: Resistors; PartId: 100100281
R65 = R0201-820k: Resistor, ±1%, 0.05W; Manufacturer: N.A.; Part number IPS: 00000001427; Note: Chip Res 1%; Pad Count: 2; Part Number: R0201-820k; Manufacturer Part Number: N.A.; LatestRevisionDate: 2014-11-13; Pin Count: 2; Publisher: Nordic Semiconductor; Published: 2014-11-13; Value: 820k; Artikkelnr Noca: N.A.; Footprint Doc: 0201; ComponentLink1URL: N.A.; ComponentLink1Description: Datasheet; ComponentLink2URL: N.A.; ComponentLink2Description: Supplier link; HelpURL: N.A.; Supplier 1: N.A.; Supplier Part Number 1: N.A.; Supplier 2: N.A.; Supplier Part Number 2: N.A.; Component Class: Resistors; PartId: 100100092
R66 = R0201-470k: Resistor, ±1%, 0.05W; Manufacturer: N.A.; Part number IPS: 00000001428; Note: Chip Res 1%; Pad Count: 2; Part Number: R0201-470k; Manufacturer Part Number: N.A.; LatestRevisionDate: 2014-11-13; Pin Count: 2; Publisher: Nordic Semiconductor; Published: 2014-11-13; Value: 470k; Artikkelnr Noca: N.A.; Footprint Doc: 0201; ComponentLink1URL: N.A.; ComponentLink1Description: Datasheet; ComponentLink2URL: N.A.; ComponentLink2Description: Supplier link; HelpURL: N.A.; Supplier 1: N.A.; Supplier Part Number 1: N.A.; Supplier 2: N.A.; Supplier Part Number 2: N.A.; Component Class: Resistors; PartId: 100100089
R71 = R0201-100k: Resistor, ±1%, 0.05W; Manufacturer: N.A.; Part number IPS: 00000001419; Note: Chip Res 1%; Pad Count: 2; Part Number: R0201-100k; Manufacturer Part Number: N.A.; LatestRevisionDate: 2014-11-13; Pin Count: 2; Publisher: Nordic Semiconductor; Published: 2014-11-13; Value: 100k; Artikkelnr Noca: N.A.; Footprint Doc: 0201; ComponentLink1URL: N.A.; ComponentLink1Description: Datasheet; ComponentLink2URL: N.A.; ComponentLink2Description: Supplier link; HelpURL: N.A.; Supplier 1: N.A.; Supplier Part Number 1: N.A.; Supplier 2: N.A.; Supplier Part Number 2: N.A.; Component Class: Resistors; PartId: 100100080
R77 = R0201-10k: Resistor, ±1%, 0.05W; Manufacturer: N.A.; Part number IPS: 00000001255; Note: Chip Res 1%; Pad Count: 2; Part Number: R0201-10k; Manufacturer Part Number: N.A.; LatestRevisionDate: 2014-11-13; Pin Count: 2; Publisher: Nordic Semiconductor; Published: 2014-11-13; Value: 10k; Artikkelnr Noca: N.A.; Footprint Doc: 0201; ComponentLink1URL: N.A.; ComponentLink1Description: Datasheet; ComponentLink2URL: N.A.; ComponentLink2Description: Supplier link; HelpURL: N.A.; Supplier 1: N.A.; Supplier Part Number 1: N.A.; Supplier 2: N.A.; Supplier Part Number 2: N.A.; Component Class: Resistors; PartId: 100100065
R78 = R0201-4R7: Resistor, ±1%, 0.05W; Manufacturer: N.A.; Part number IPS: 00000002486; Note: Chip Res 1%; Pad Count: 2; Part Number: R0201-4R7; Manufacturer Part Number: N.A.; LatestRevisionDate: 2014-11-13; Pin Count: 2; Publisher: Nordic Semiconductor; Published: 2014-11-13; Value: 4R7; Artikkelnr Noca: N.A.; Footprint Doc: 0201; ComponentLink1URL: N.A.; ComponentLink1Description: Datasheet; ComponentLink2URL: N.A.; ComponentLink2Description: Supplier link; HelpURL: N.A.; Supplier 1: N.A.; Supplier Part Number 1: N.A.; Supplier 2: N.A.; Supplier Part Number 2: N.A.; Component Class: Resistors; PartId: 100100010
SB34-SB37 SB39 SB48 SB80 SB81 = Solderbridge: Manufacturer: N.A.; Pad Count: 2; Part Number: Solderbridge; Manufacturer Part Number: N.A.; LatestRevisionDate: 2009-12-14; Pin Count: 2; Publisher: Nordic Semiconductor; Published: 2009-12-14; Value: Solderbridge; Note: N.A.; Artikkelnr Noca: N.A.; Footprint Doc: Solderbridge; Part number IPS: N.A.; ComponentLink1URL: N.A.; ComponentLink1Description: Datasheet; ComponentLink2URL: N.A.; ComponentLink2Description: Supplier link; HelpURL: N.A.; Supplier 1: N.A.; Supplier Part Number 1: N.A.; Supplier 2: N.A.; Supplier Part Number 2: N.A.; Component Class: Connectors; PartId: 100500458
SB38 SB40 SB41 SB58 = Solderbridge Shorted: Shorted Solderbridge; Manufacturer: N.A.; Pad Count: 2; Part Number: Solderbridge Shorted; Manufacturer Part Number: N.A.; LatestRevisionDate: 2012-08-07; Pin Count: 2; Publisher: Nordic Semiconductor; Published: 2012-08-07; Value: Solderbridge; Note: N.A.; Artikkelnr Noca: N.A.; Footprint Doc: Solderbridge_Shorted; Part number IPS: N.A.; ComponentLink1URL: N.A.; ComponentLink1Description: Datasheet; ComponentLink2URL: N.A.; ComponentLink2Description: Supplier link; HelpURL: N.A.; Supplier 1: N.A.; Supplier Part Number 1: N.A.; Supplier 2: N.A.; Supplier Part Number 2: N.A.; Component Class: Connectors; PartId: 100500459
SW8 = MK-22D14-G2: Slide Switch DPDT; Manufacturer: HUA-JIE CORP.; Note: N.A.; Pad Count: 6; Part Number: MK-22D14-G2; Manufacturer Part Number: MK-22D14-G2; Footprint Doc: MK-22D14-G2; LatestRevisionDate: 2020-10-06; Published: 2020-12-01; Value: MK-22D14-G2; Artikkelnr Noca: N.A.; Part number IPS: N.A.; ComponentLink1URL: N.A.; ComponentLink1Description: Datasheet; ComponentLink2URL: N.A.; ComponentLink2Description: Supplier link; HelpURL: N.A.; Supplier 1: Cabcon; Supplier Part Number 1: MK-22D14-G2; Supplier 2: N.A.; Supplier Part Number 2: N.A.; Component Class: Switches; PartId: 101500131; Author: rsk; Part number Norautron: N.A.
SW9 = JS203011JCQN: Slide Switch DP3T 300mA 6V; Manufacturer: C&K; Part number IPS: 00000004321; Note: N.A.; Artikkelnr Noca: 50019116; Pad Count: 8; Part Number: JS203011JCQN; Manufacturer Part Number: JS203011JCQN; Footprint Doc: Switch-Slide-J-Lead-DP3T-13x3.5mm; LatestRevisionDate: 2016-10-05; Pin Count: 8; Publisher: Nordic Semiconductor; Published: 2016-10-05; Value: JS203011JCQN; ComponentLink1URL: N.A.; ComponentLink1Description: Datasheet; ComponentLink2URL: N.A.; ComponentLink2Description: Supplier link; HelpURL: http://www.ckswitches.com/media/1422/js.pdf; Supplier 1: Digi-Key; Supplier Part Number 1: CKN10725CT-ND; Supplier 2: N.A.; Supplier Part Number 2: N.A.; Component Class: Switches; PartId: 101500099
SW10 = CAS-220TA: Slide Switch DPDT J Hook; Manufacturer: Copal Electronics Inc; Part number IPS: 00000009983; Note: N.A.; Artikkelnr Noca: 50019042; Pad Count: 6; Part Number: CAS-220TA; Manufacturer Part Number: CAS-220TA; Footprint Doc: CAS-220TA; LatestRevisionDate: 2010-02-18; Pin Count: 6; Publisher: Nordic Semiconductor; Published: 2010-02-18; Value: CAS-220TA; ComponentLink1URL: N.A.; ComponentLink1Description: Datasheet; ComponentLink2URL: N.A.; ComponentLink2Description: Supplier link; HelpURL: http://media.digikey.com/pdf/Data%20Sheets/COPAL%20Electronics%20PDFs/CAS%20SMD%20Slide%20Switch.pdf; Supplier 1: Digi-Key; Supplier Part Number 1: CAS220JTR-ND; Supplier 2: N.A.; Supplier Part Number 2: N.A.; Component Class: Switches; PartId: 101500003
TP24-TP28 TP30 TP32 TP35 TP37-TP39 = TP_SMD_Ø1.5MM: 1.5mm circular SMD testpad; Manufacturer: Nordic Semiconductor; Manufacturer Part Number: N.A.; Pad Count: 1; Part Number: TP_SMD_Ø1.5MM; LatestRevisionDate: 2016-06-02; Pin Count: 1; Publisher: Nordic Semiconductor; Published: 2016-06-02; Value: Ø1.5mm,SMD; Note: N.A.; Artikkelnr Noca: N.A.; Footprint Doc: TP_SMD_Ø1.5mm; Part number IPS: N.A.; ComponentLink1URL: N.A.; ComponentLink1Description: Datasheet; ComponentLink2URL: N.A.; ComponentLink2Description: Supplier link; HelpURL: N.A.; Supplier 1: N.A.; Supplier Part Number 1: N.A.; Supplier 2: N.A.; Supplier Part Number 2: N.A.; Component Class: Connectors; PartId: 100500477
TP29 TP33 TP34 TP36 = TP_SMD_Ø1.0MM: 1.0mm circular SMD testpad; Manufacturer: Nordic Semiconductor; Manufacturer Part Number: N.A.; Pad Count: 1; Part Number: TP_SMD_Ø1.0MM; LatestRevisionDate: 2013-06-11; Pin Count: 1; Publisher: Nordic Semiconductor; Published: 2013-06-11; Value: Ø1.0mm,SMD; Note: N.A.; Artikkelnr Noca: N.A.; Footprint Doc: TP_SMD_Ø1.0mm; Part number IPS: N.A.; ComponentLink1URL: N.A.; ComponentLink1Description: Datasheet; ComponentLink2URL: N.A.; ComponentLink2Description: Supplier link; HelpURL: N.A.; Supplier 1: N.A.; Supplier Part Number 1: N.A.; Supplier 2: N.A.; Supplier Part Number 2: N.A.; Component Class: Connectors; PartId: 100500475
TP40 TP41 = Testpoint TH: Testpoint, through hole; Manufacturer: N.A.; Pad Count: 1; Part Number: Testpoint TH; Manufacturer Part Number: N.A.; Footprint Doc: TESTPAD-TH; LatestRevisionDate: 2009-12-12; Pin Count: 1; Publisher: Nordic Semiconductor; Published: 2009-12-12; Value: TP; Note: N.A.; Artikkelnr Noca: N.A.; Part number IPS: N.A.; ComponentLink1URL: N.A.; ComponentLink1Description: Datasheet; ComponentLink2URL: N.A.; ComponentLink2Description: Supplier link; HelpURL: N.A.; Supplier 1: N.A.; Supplier Part Number 1: N.A.; Supplier 2: N.A.; Supplier Part Number 2: N.A.; Component Class: Connectors; PartId: 100500464
U9 = TS27L2IPT: Precision very low power CMOS dual operational amplifier; Manufacturer: STMicroelectronics; Part number IPS: 00000009991; Note: N.A.; Artikkelnr Noca: 17010019; Pad Count: 8; Part Number: TS27L2IPT; Manufacturer Part Number: TS27L2IPT; Footprint Doc: TSSOP-8; LatestRevisionDate: 2016-07-07; Pin Count: 8; Publisher: Nordic Semiconductor; Published: 2016-07-07; Value: TS27L2IPT; ComponentLink1URL: N.A.; ComponentLink1Description: Datasheet; ComponentLink2URL: N.A.; ComponentLink2Description: Supplier link; HelpURL: http://www.st.com/content/ccc/resource/technical/document/datasheet/38/5b/ca/bd/c0/26/4a/34/CD00000880.pdf/files/CD00000880.pdf/jcr:content/translations/en.CD00000880.pdf; Supplier 1: Digi-Key; Supplier Part Number 1: 497-8085-1-ND; Supplier 2: N.A.; Supplier Part Number 2: N.A.; Component Class: Misc_ICs; PartId: 101900442
U10 = XC9131H05CDR-G: 1A Driver Transistor Built-In, Multi Functional Step-Up DC/DC Converter; Manufacturer: Torex Semiconductor; Part number IPS: 00000009990; Note: N.A.; Artikkelnr Noca: 17030086; Pad Count: 10; Part Number: XC9131H05CDR-G; Manufacturer Part Number: XC9131H05CDR-G; Footprint Doc: UFDFN-10; LatestRevisionDate: 2016-08-08; Pin Count: 10; Publisher: Nordic Semiconductor; Published: 2016-08-08; Value: XC9131; ComponentLink1URL: N.A.; ComponentLink1Description: Datasheet; ComponentLink2URL: N.A.; ComponentLink2Description: Supplier link; HelpURL: http://www.torexsemi.com/products/dcdc_converters/data/XC9131.pdf; Supplier 1: Digi-Key; Supplier Part Number 1: XC9131H05CDR-G-ND; Supplier 2: N.A.; Supplier Part Number 2: N.A.; Component Class: Misc_ICs; PartId: 101900205
U11 = XC9236D08CER-G: 600mA Driver Transistor Built-In, Synchronous Step-Down DC/DC Converters; Manufacturer: Torex Semiconductor; Part number IPS: 00000004325; Note: N.A.; Artikkelnr Noca: 17030085; Pad Count: 6; Part Number: XC9236D08CER-G; Manufacturer Part Number: XC9236D08CER-G; Footprint Doc: USP-6C; LatestRevisionDate: 2017-11-15; Pin Count: 6; Publisher: Nordic Semiconductor; Published: 2017-11-15; Value: XC9236; ComponentLink1URL: N.A.; ComponentLink1Description: Datasheet; ComponentLink2URL: N.A.; ComponentLink2Description: Supplier link; HelpURL: http://www.torexsemi.com/products/dcdc_converters/data/XC9235~37.pdf; Supplier 1: Mouser; Supplier Part Number 1: 865-XC9236D08CER-G; Supplier 2: Digi-Key; Supplier Part Number 2: XC9236D08CER-G-ND; Component Class: Misc_ICs; PartId: 101900207
U12-U15 U17 U19 U20 U22 U23 = TCK106AG: 1.0 A Load Switch IC with Slew Rate Control Driver in Ultra Small Package; Manufacturer: Toshiba; Manufacturer Part Number: TCK106AG,LF; Part number IPS: 00000004390; Note: N.A.; Pad Count: 4; Part Number: TCK106AG; ComponentLink1URL: https://toshiba.semicon-storage.com/info/docget.jsp?did=30131&prodName=TCK106AG; ComponentLink1Description: Datasheet; ComponentLink2URL: N.A.; ComponentLink2Description: Supplier link; HelpURL: N.A.; Footprint Doc: WLCSP-4; LatestRevisionDate: 2019-03-01; Pin Count: 4; Publisher: Nordic Semiconductor; Published: 2019-02-17; Value: TCK106AG; Supplier 1: Digi-Key; Supplier Part Number 1: TCK106AGLFTR-ND; Supplier 2: Mouser; Supplier Part Number 2: 757-TCK106AGLF; Artikkelnr Noca: N.A.; Component Class: Misc_ICs; PartId: 101900575
U16 U24 = 74LVC1G08GW: Single 2-Input AND Gate; Manufacturer: NXP Semiconductors; Part number IPS: 00000009992; Artikkelnr Noca: 15049058; Pad Count: 5; Part Number: 74LVC1G08GW; Manufacturer Part Number: 74LVC1G08GW; Footprint Doc: SC70-5; LatestRevisionDate: 2016-10-18; Pin Count: 5; Publisher: Nordic Semiconductor; Published: 2016-10-18; Value: 74LVC1G08; Note: Single 2-Input AND Gate; ComponentLink1URL: N.A.; ComponentLink1Description: Datasheet; ComponentLink2URL: N.A.; ComponentLink2Description: Supplier link; HelpURL: http://www.nxp.com/documents/data_sheet/74LVC1G08.pdf; Supplier 1: Digi-Key; Supplier Part Number 1: 568-1580-1-ND; Supplier 2: Farnell; Supplier Part Number 2: 242-8299; Component Class: Misc_ICs; PartId: 101900155
U18 U21 = 74LVC1G11GW: Single 3-input AND gate; Manufacturer: NXP Semiconductors; Part number IPS: 00000001430; Artikkelnr Noca: 15079348; Pad Count: 6; Part Number: 74LVC1G11GW; Manufacturer Part Number: 74LVC1G11GW; Footprint Doc: SC70-6; LatestRevisionDate: 2016-10-18; Pin Count: 6; Publisher: Nordic Semiconductor; Published: 2016-10-18; Value: 74LVC1G11; Note: Single 3-input AND gate; ComponentLink1URL: N.A.; ComponentLink1Description: Datasheet; ComponentLink2URL: N.A.; ComponentLink2Description: Supplier link; HelpURL: http://www.nxp.com/documents/data_sheet/74LVC1G11.pdf; Supplier 1: Digi-Key; Supplier Part Number 1: 568-7757-1-ND; Supplier 2: Farnell; Supplier Part Number 2: 243-8826; Component Class: Misc_ICs; PartId: 101900157